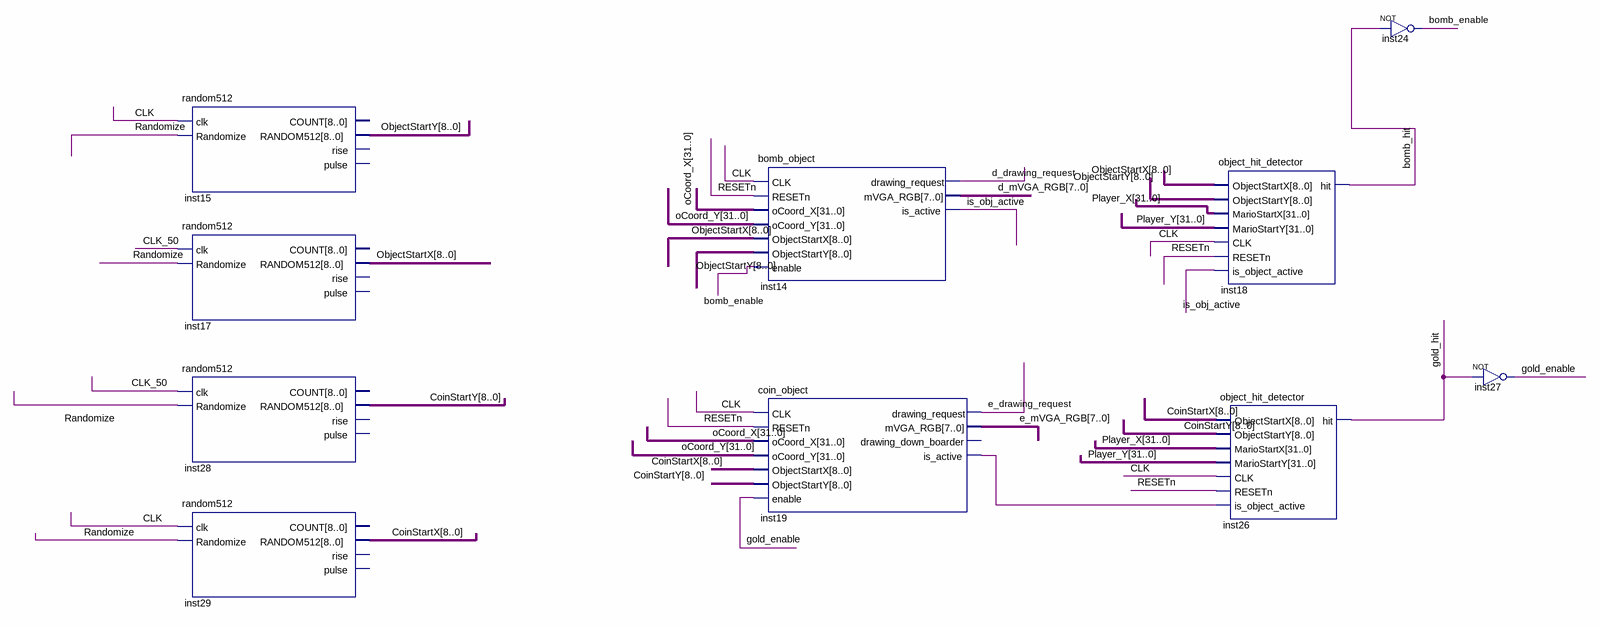
[diagram p0: schematic sheet]
// Quartus schematic GoldCoin.bdf as structural Verilog: 10 symbols, 0 pins
module GoldCoin (
);

  wire bomb_enable, bomb_hit, CLK, CLK_50, d_drawing_request, e_drawing_request, gold_enable, gold_hit,
       inst19_is_active, is_obj_active, Randomize, RESETn;
  wire [7:0] d_mVGA_RGB, e_mVGA_RGB;
  wire [8:0] CoinStartX, CoinStartY, ObjectStartX, ObjectStartY;
  wire [31:0] oCoord_X, oCoord_Y, Player_X, Player_Y;

  random512 inst15 (.clk(CLK), .Randomize(Randomize), .RANDOM512(ObjectStartY));  // open: COUNT, rise, pulse
  random512 inst17 (.clk(CLK_50), .Randomize(Randomize), .RANDOM512(ObjectStartX));  // open: COUNT, rise, pulse
  random512 inst28 (.clk(CLK_50), .Randomize(Randomize), .RANDOM512(CoinStartY));  // open: COUNT, rise, pulse
  random512 inst29 (.clk(CLK), .Randomize(Randomize), .RANDOM512(CoinStartX));  // open: COUNT, rise, pulse
  bomb_object inst14 (
    .CLK(CLK), .RESETn(RESETn), .oCoord_X(oCoord_X), .oCoord_Y(oCoord_Y), .ObjectStartX(ObjectStartX),
    .ObjectStartY(ObjectStartY), .enable(bomb_enable), .drawing_request(d_drawing_request),
    .mVGA_RGB(d_mVGA_RGB), .is_active(is_obj_active));
  coin_object inst19 (
    .CLK(CLK), .RESETn(RESETn), .oCoord_X(oCoord_X), .oCoord_Y(oCoord_Y), .ObjectStartX(CoinStartX),
    .ObjectStartY(CoinStartY), .enable(gold_enable), .drawing_request(e_drawing_request),
    .mVGA_RGB(e_mVGA_RGB), .is_active(inst19_is_active));  // open: drawing_down_boarder
  object_hit_detector inst18 (
    .ObjectStartX(ObjectStartX), .ObjectStartY(ObjectStartY), .MarioStartX(Player_X), .MarioStartY(Player_Y),
    .CLK(CLK), .RESETn(RESETn), .is_object_active(is_obj_active), .hit(bomb_hit));
  object_hit_detector inst26 (
    .ObjectStartX(CoinStartX), .ObjectStartY(CoinStartY), .MarioStartX(Player_X), .MarioStartY(Player_Y),
    .CLK(CLK), .RESETn(RESETn), .is_object_active(inst19_is_active), .hit(gold_hit));
  not inst24 (bomb_enable, bomb_hit);
  not inst27 (gold_enable, gold_hit);
endmodule
